# EAGLE design esp_nfc (EAGLE 7.1.0)
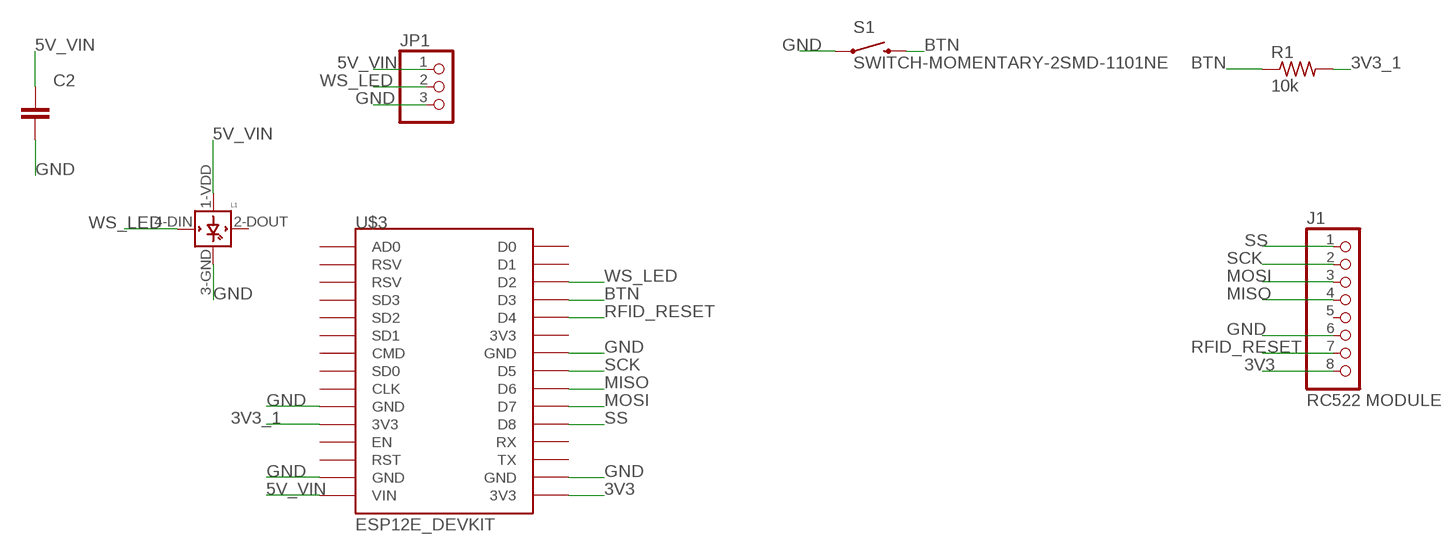
[diagram p0: schematic, sheet 1]

## Parts
C2  CAPACITOR_NPOL-0603  [C603]
J1  RC522 MODULE  PINHD-1X8LOCK  [1X08-LOCK]
JP1  PINHD-1X3  [1X03]
L1  WS2812B  [WS2812B]
R1  10k  RESISTOR0603  [R0603]
S1  SWITCH-MOMENTARY-2SMD-1101NE  [TACTILE-SWITCH-1101NE]
U$3  ESP12E_DEVKIT  [ESP12E_DEVKIT]

## Nets
3V3: J1.8 U$3.3V3@2(3V3)
3V3_1: R1.2 U$3.3V3@0(3V3)
5V_VIN: C2.1 JP1.1 L1.1-VDD(VDD) U$3.VIN
BTN: R1.1 S1.2 U$3.D3
GND: C2.2 J1.6 JP1.3 L1.3-GND(GND) S1.1 U$3.GND@0(GND) U$3.GND@1(GND) U$3.GND@2(GND) U$3.GND@3(GND)
MISO: J1.4 U$3.D6
MOSI: J1.3 U$3.D7
RFID_RESET: J1.7 U$3.D4
SCK: J1.2 U$3.D5
SS: J1.1 U$3.D8
WS_LED: JP1.2 L1.4-DIN(DIN) U$3.D2
Unconnected: J1.5 L1.2-DOUT(DOUT) U$3.3V3@1(3V3) U$3.AD0 U$3.CLK U$3.CMD U$3.D0 U$3.D1 U$3.EN U$3.RST U$3.RSV@0(RSV) U$3.RSV@1(RSV) U$3.RX U$3.SD0 U$3.SD1 U$3.SD2 U$3.SD3 U$3.TX

## Library data of the parts
C2 = dp_devices:CAPACITOR_NPOL: Non-Polarized capacitor in various packages
J1 = adafruit:PINHD-1X8: PIN HEADER
JP1 = adafruit:PINHD-1X3: PIN HEADER
L1 = adafruit:WS2812B
R1 = CEDT:RESISTOR
S1 = SparkFun-Electromechanical:SWITCH-MOMENTARY-2: Various NO switches- pushbuttons, reed, etc; PROD_ID: SWCH-00815
U$3 = ESP12E_DEVKIT:ESP12E_DEVKIT: ESP12E DEVKIT BOARD

## Board
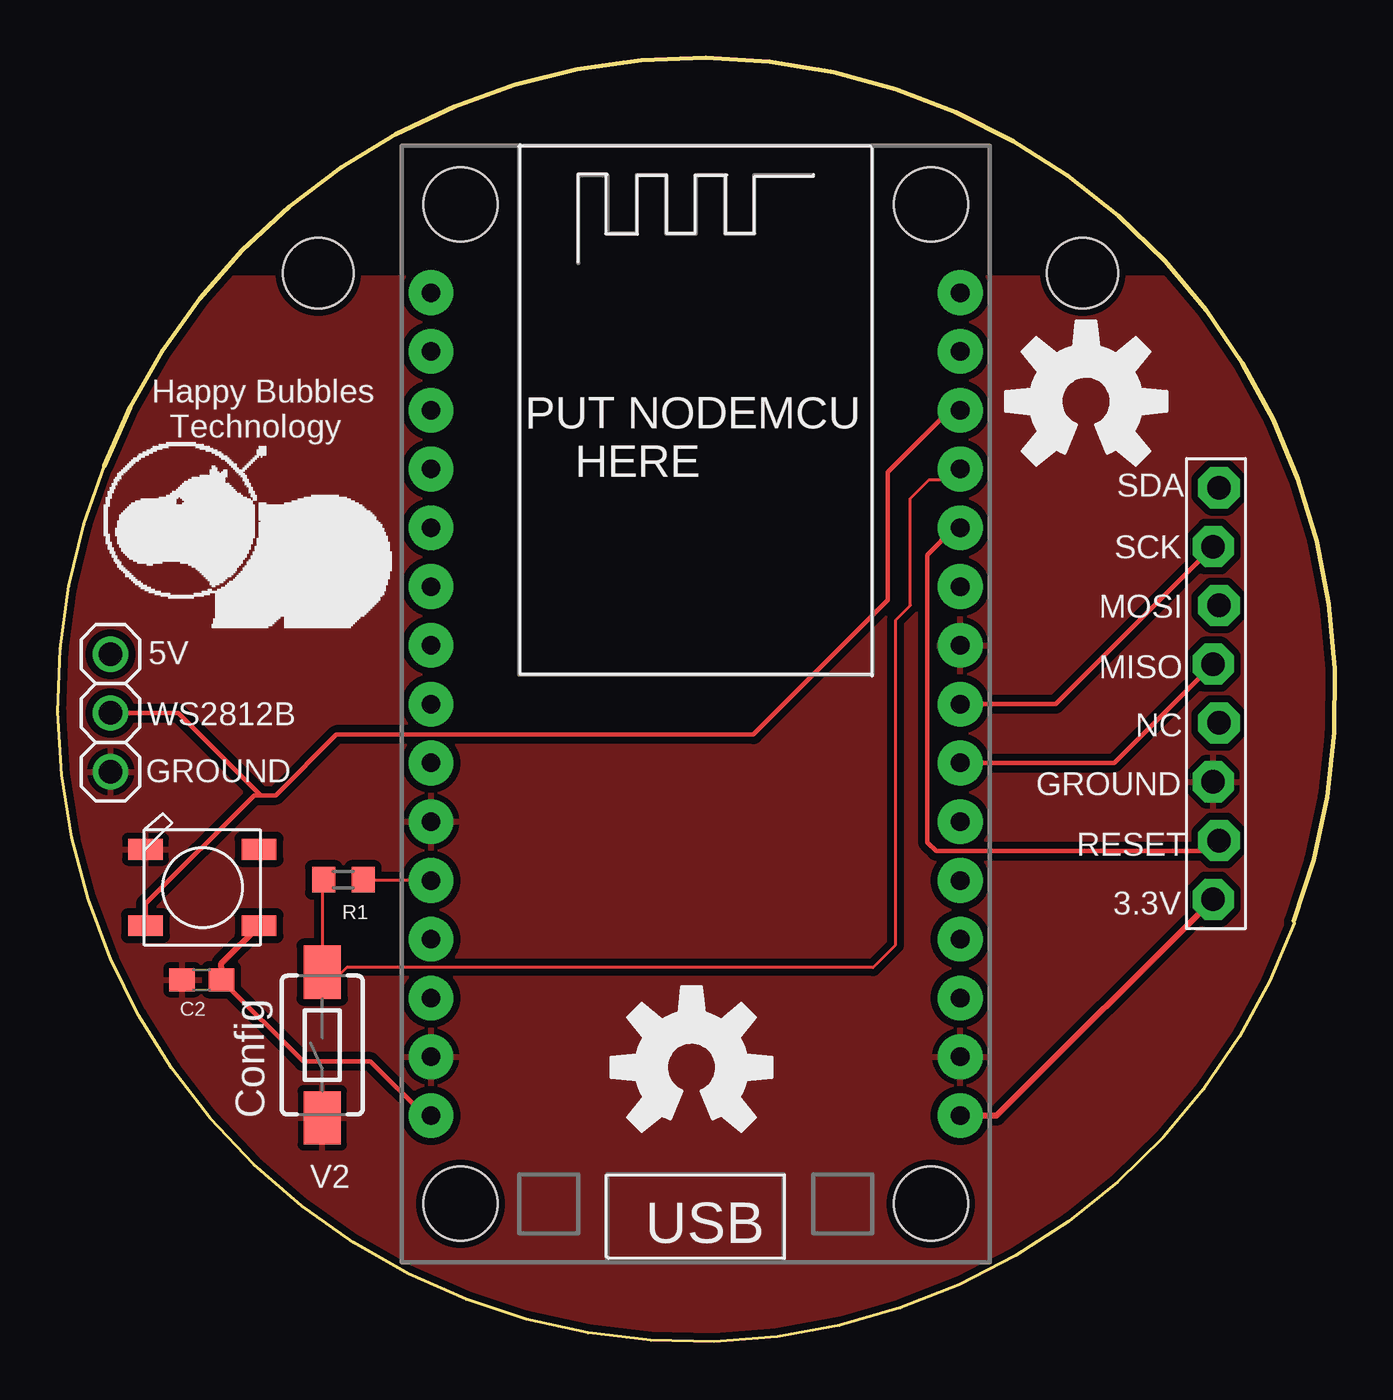
[diagram p1: board, top side]
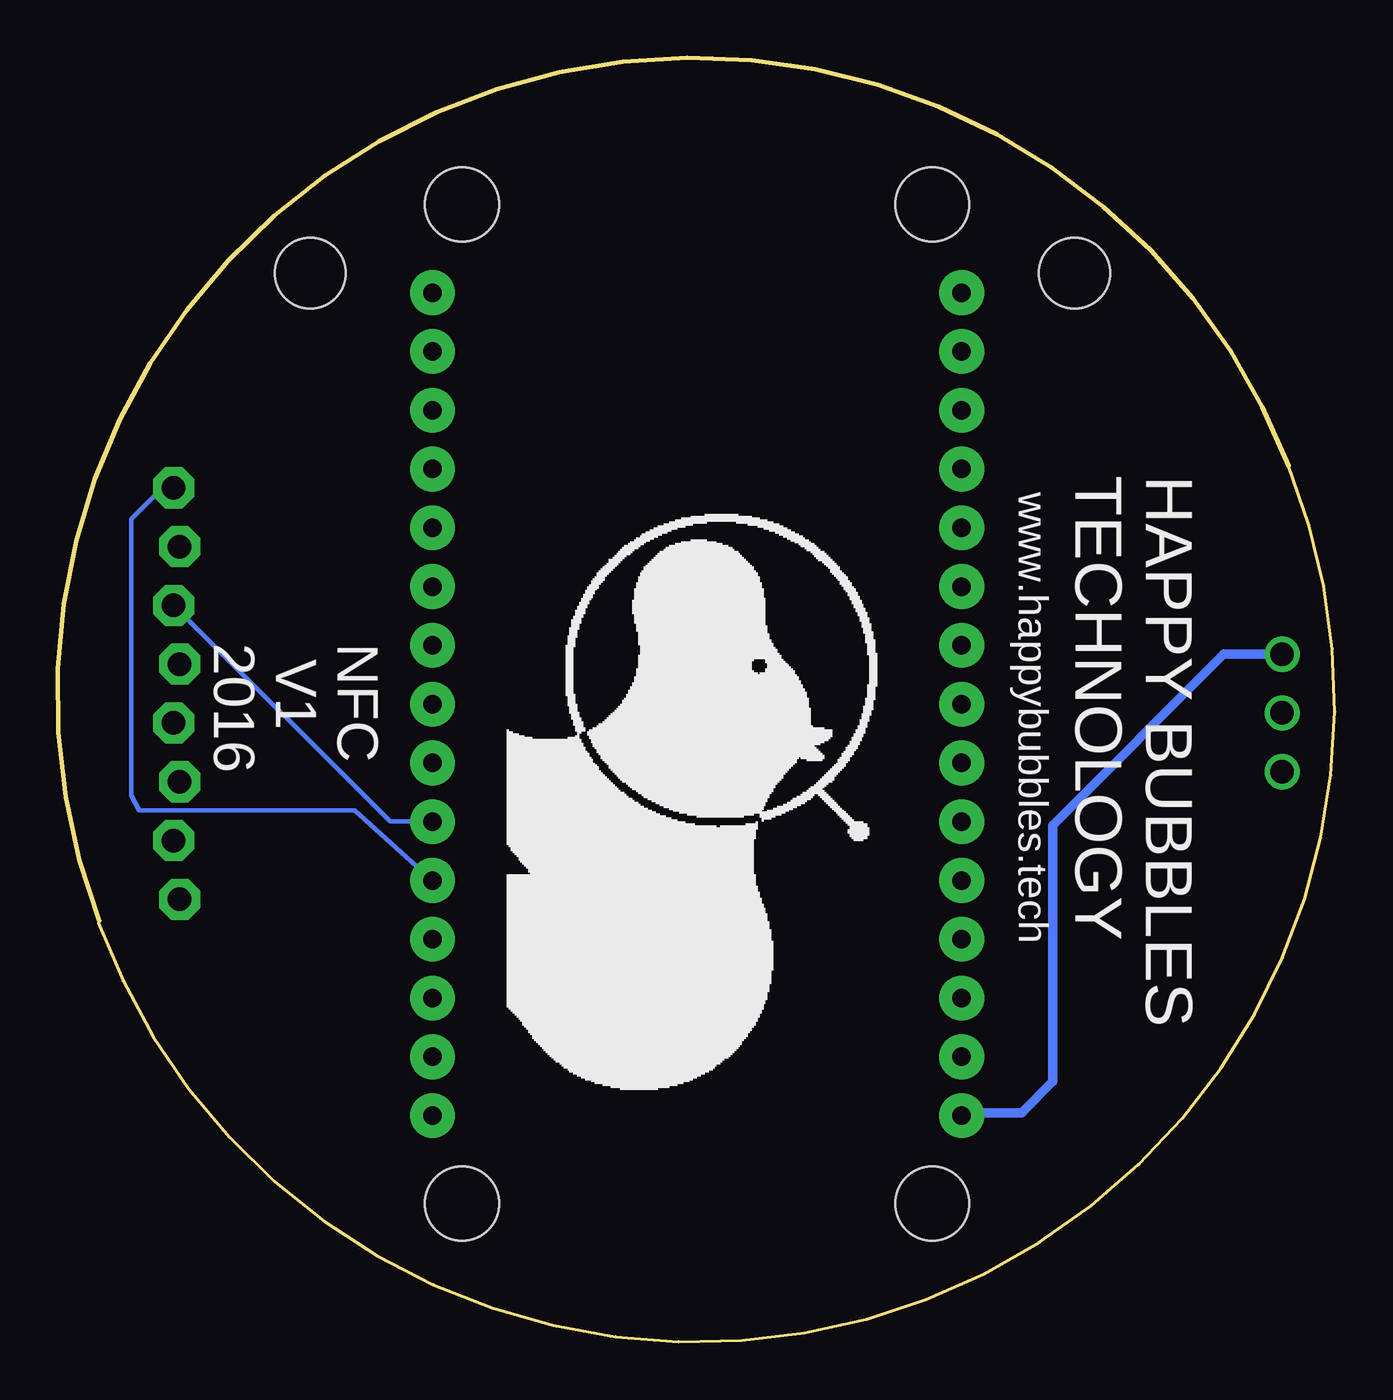
[diagram p2: board, bottom side, seen from below]

Size 55.16 x 55.47 mm. Coordinates in mm from the lower left corner, seen from the top.
Outline: 53.41,18.1 arc-182 2.02,37.89
Outline: 2,37.83 arc-180 53.38,18.17
Copper layers (1*16): Top 0.035mm / dielectric 1.5mm / Bottom 0.035mm
Design rules "dirt_cheap_dirty_boards.v1": minimum track width 5mil, minimum drill 12mil, track to track 5mil, track to pad 5mil, pad to pad 5mil, via to via 5mil, smd to smd 0mil, copper to edge 10mil, drill to drill 10mil, minimum pad ring 10mil, minimum via ring 6mil, stop-mask expansion 2mil, vias tented up to drill 25mil, thermal gap 10mil
Holes 3.06 mm at 11.24,46.17 44.26,46.17

### Footprints (pad centres in the part's own frame; a part is rotated, then mirrored left to right if it is on the bottom)
C603 = smd 1.1 x 1: 1 -0.85,0; 2 0.85,0
1X08-LOCK = drill 1.016 pad 1.778 octagon: 1 -8.89,0.127; 2 -6.35,-0.127; 3 -3.81,0.127; 4 -1.27,-0.127; 5 1.27,0.127; 6 3.81,-0.127; 7 6.35,0.127; 8 8.89,-0.127
1X03 = drill 1.016: 1 -2.54,0; 2 0,0; 3 2.54,0
WS2812B = smd 1.5 x 0.9: 1-VDD 2.45,-1.65; 2-DOUT 2.45,1.65; 3-GND -2.45,1.65; 4-DIN -2.45,-1.65
R0603 = smd 1 x 1.1: 1 -0.85,0; 2 0.85,0
TACTILE-SWITCH-1101NE = smd 2.3 x 1.6: 1 -3.15,0; 2 3.15,0
ESP12E_DEVKIT = drill 0.8 pad 1.93: 3V3@0 -11.43,-7.62; 3V3@1 11.43,5.08; 3V3@2 11.43,-17.78; AD0 -11.43,17.78; CLK -11.43,-2.54; CMD -11.43,2.54; D0 11.43,17.78; D1 11.43,15.24; D2 11.43,12.7; D3 11.43,10.16; D4 11.43,7.62; D5 11.43,0; D6 11.43,-2.54; D7 11.43,-5.08; D8 11.43,-7.62; EN -11.43,-10.16; GND@0 -11.43,-5.08; GND@1 -11.43,-15.24; GND@2 11.43,2.54; GND@3 11.43,-15.24; RST -11.43,-12.7; RSV@0 -11.43,15.24; RSV@1 -11.43,12.7; RX 11.43,-10.16; SD0 -11.43,0; SD1 -11.43,5.08; SD2 -11.43,7.62; SD3 -11.43,10.16; TX 11.43,-12.7; VIN -11.43,-17.78 | hole 3.2: -10.16,21.59; 10.16,21.59; 10.16,-21.59; -10.16,-21.59

### Placement (x,y rotation side)
C2  6.21,15.64 180 top
J1  50.03,28.01 270 top
JP1  2.28,27.17 270 top
L1  6.24,19.62 0 top
R1  12.33,19.95 0 top
S1  11.42,12.82 90 top
U$1  [HAPPY_HIPPO_500MIL]  2.02,30.88 0 top
U$3  27.55,27.55 0 top
U$4  [OSHW-LOGO-L]  44.41,40.63 0 top
U$5  [HAPPY_HIPPO]  35.73,35.73 270 bottom
U$6  [OSHW-LOGO-L]  27.37,11.85 0 top

### Tracks (layer width: path | path; a pad name or v marks a point on that pad's centre or on a via)
3V3
  Top 0.254: U$3.3V3@2 40.55,9.77 J1.8
3V3_1
  Top 0.127: R1.2 16.09,19.95 U$3.3V3@0
5V_VIN
  Top 0.203: 7.06,16.17 C2.1 10.59,12.1 13.5,12.1 15.84,9.77 U$3.VIN
  Top 0.254: 7.06,16.17 7.06,16.35 L1.1-VDD
  Bottom 0.406: JP1.1 4.79,29.71 12.18,22.32 12.18,11.24 13.53,9.89 15.99,9.89 U$3.VIN
BTN
  Top 0.127: R1.1 11.42,19.89 S1.2 11.32,15.97 11.01,15.66 11.98,15.66 12.49,16.17 35.22,16.17 36.19,17.13 36.19,31.18 36.82,31.81 36.82,36.44 37.63,37.25 38.52,37.25 U$3.D3
GND
  pour Top (isolate 0.305): -0.01,-2.42 -0.26,-2.42 0.37,46.04 55.16,46.01 55.82,-2.27
MISO
  Top 0.203: U$3.D6 45.63,25.01 J1.4
MOSI
  Bottom 0.203: U$3.D7 40.81,22.47 J1.3
RFID_RESET
  Top 0.203: U$3.D4 38.73,35.17 37.56,34 37.56,21.58 37.94,21.2 49.7,21.2 J1.7
SCK
  Top 0.203: U$3.D5 43.09,27.55 J1.2
SS
  Bottom 0.203: J1.1 50.64,36.89 51.98,35.55 51.98,23.61 51.65,22.95 42.33,22.95 U$3.D8
WS_LED
  Top 0.203: 38.52,40.25 35.86,37.58 35.86,32.04 30.04,26.23 12.03,26.23 9.41,23.61 8.75,23.61 | L1.4-DIN 3.79,18.93 8.47,23.61 8.75,23.61 | JP1.2 5.2,27.17 8.75,23.61
  Top 0.254: 38.52,40.25 U$3.D2

### Text on the board
tNames: Happy Bubbles / Technology | PUT NODEMCU / HERE | SDA | SCK | MOSI | 5V | MISO | WS2812B | NC | GROUND | GROUND | RESET | 3.3V | Config | V2 | USB
bNames: HAPPY BUBBLES / TECHNOLOGY | www.happybubbles.tech | NFC / V1 / 2016